# EAGLE design untitled (EAGLE 7.2.0)
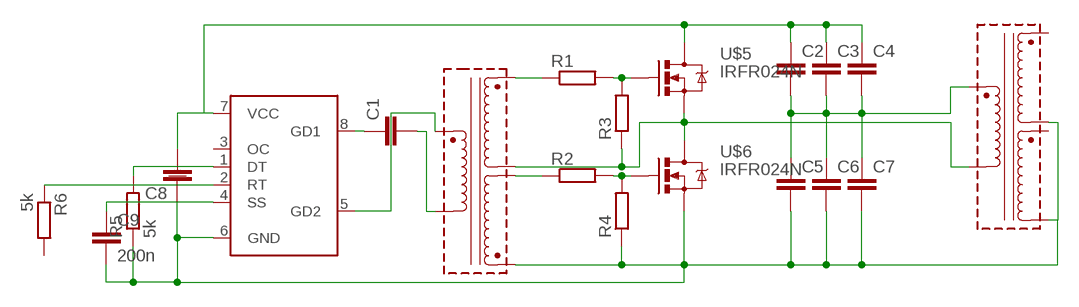
[diagram p0: schematic, sheet 1]

## Parts
C1  CC0805  [C0805]
C2  CC0805  [C0805]
C3  CC0805  [C0805]
C4  CC0805  [C0805]
C5  CC0805  [C0805]
C6  CC0805  [C0805]
C7  CC0805  [C0805]
C8  CC0805  [C0805]
C9  200n  CC0805  [C0805]
R1  R0805  [R0805]
R2  R0805  [R0805]
R3  R0805  [R0805]
R4  R0805  [R0805]
R5  5k  R0805  [R0805]
R6  5k  R0805  [R0805]
U$1  TPS92020  [SO08]
U$2  ADSL_GDT  [ADSL_GDT]
U$3  CCFL  [TRANSFORMER_HVX2]
U$5  IRFR024N  [D-PAK_TO252AA]
U$6  IRFR024N  [D-PAK_TO252AA]

## Nets
N$1: C1.1 U$1.8(GD1)
N$2: C1.2 U$2.GD`(GD2)
N$3: U$1.5(GD2) U$2.GD(GD1)
N$4: R1.1 U$2.OUT1(OUT1+)
N$5: R2.1 U$2.OUT2`(OUT2-)
N$6: R1.2 R3.2 U$5.1(G)
N$7: R2.2 R4.2 U$6.1(G)
N$8: R3.1 U$2.OUT1`(OUT1-) U$3.P$3(GD2) U$5.3(S) U$6.2(D)
N$9: C5.2 C6.2 C7.2 C8.1 C9.2 R4.1 R5.1 U$1.6(GND) U$2.OUT2(OUT2+) U$3.P$6(OUT1-) U$3.P$7(OUT2+) U$6.3(S)
N$10: C2.2 C3.2 C4.2 C5.1 C6.1 C7.1 U$3.P$2(GD1)
N$11: C2.1 C3.1 C4.1 C8.2 U$1.7(VCC) U$5.2(D)
N$12: R5.2 U$1.1(DT)
N$13: C9.1 U$1.4(SS)
N$14: R6.1 U$1.2(RT)
Unconnected: R6.2 U$1.3(OC) U$3.P$5(OUT1+) U$3.P$8(OUT2-)

## Library data of the parts
C1-C9 = CasaLibrary:C: Capacitor
R1-R6 = CasaLibrary:R
U$1 = CasaLibrary:TPS92020
U$2 = CasaLibrary:ADSL_GDT
U$3 = CasaLibrary:CCFL
U$5 U$6 = CasaLibrary:IRFR024N

## Board
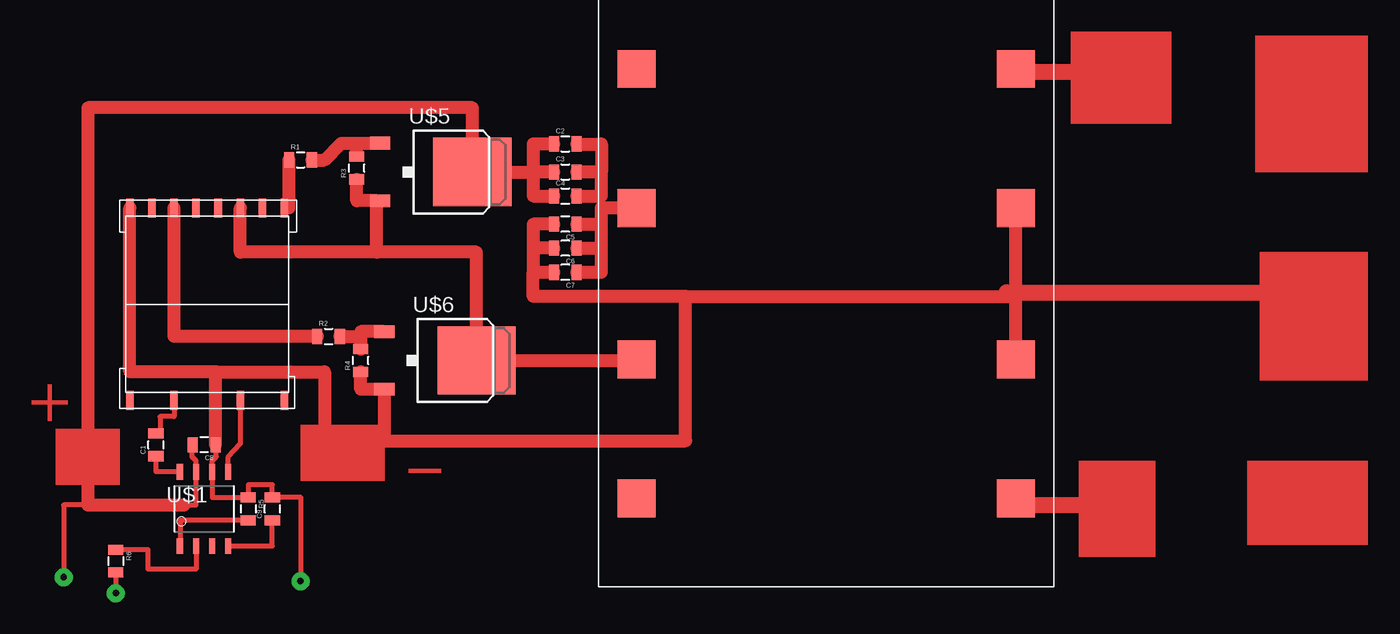
[diagram p1: board, top side]

No outline drawn. Coordinates in mm, seen from the top.
Copper layers (1*16): Top 0.035mm / dielectric 1.5mm / Bottom 0.035mm
Design rules "default": minimum track width 0.2mm, minimum drill 0.2mm, track to track 0.2mm, track to pad 0.2mm, pad to pad 0.2mm, via to via 0.2mm, smd to smd 0.2mm, copper to edge 0.2mm, drill to drill 0.2mm, minimum pad ring 10mil, minimum via ring 8mil, stop-mask expansion 4mil, vias tented up to drill 0mil, thermal gap 10mil

### Footprints (pad centres in the part's own frame; a part is rotated, then mirrored left to right if it is on the bottom)
C0805 = smd 0.8 x 1.2: 1 -0.9,0; 2 0.9,0
R0805 = smd 0.8 x 1.2: 1 -0.9,0; 2 0.9,0
SO08 = smd 0.5 x 1.25: 1 -1.905,-2.934; 2 -0.635,-2.934; 3 0.635,-2.934; 4 1.905,-2.934; 5 1.905,2.934; 6 0.635,2.934; 7 -0.635,2.934; 8 -1.905,2.934
ADSL_GDT = smd 0.6 x 1.5: GD -2.54,8.255; GD` 2.699,8.255; NC -4.286,-6.985; NC@1 -0.794,-6.985; NC@2 0.953,-6.985; NC@3 4.445,-6.985; NC@4 -6.032,8.255; NC@5 6.191,8.255; OUT1 -6.032,-6.985; OUT1` -2.54,-6.985; OUT2 6.191,-6.985; OUT2` 2.699,-6.985
TRANSFORMER_HVX2 = smd 3 x 3: P$1 -18,-15; P$2 -7,-15; P$3 5,-15; P$4 16,-15; P$5 -18,15; P$6 -7,15; P$7 5,15; P$8 16,15
D-PAK_TO252AA = smd 1 x 1.6: 1 -2.28,-4.8; 3 2.28,-4.8 | smd 5.4 x 6.2: 2 0,2.5

### Placement (x,y rotation side)
C1  10.48,20.64 90 top
C2  42.86,44.45 0 top
C3  42.86,42.23 0 top
C4  42.86,40.32 0 top
C5  42.86,38.1 180 top
C6  42.86,36.2 180 top
C7  42.86,34.29 180 top
C8  14.29,20.64 180 top
C9  19.68,15.56 90 top
R1  21.91,43.18 0 top
R2  24.13,29.21 0 top
R3  26.35,42.55 90 top
R4  26.67,27.3 90 top
R5  17.78,15.56 270 top
R6  7.3,11.43 270 top
U$1  14.29,15.56 0 top
U$2  14.61,32.38 180 top
U$3  63.5,32.38 270 top
U$5  33.02,42.23 270 top
U$6  33.34,27.3 270 top

### Tracks (layer width: path | path; a pad name or v marks a point on that pad's centre or on a via)
N$1
  Top 0.406: U$1.8 10.48,18.49 C1.1
N$2
  Top 0.406: U$2.GD` 11.91,22.86 10.79,22.86 10.79,21.54 C1.2
N$3
  Top 0.406: U$1.5 16.19,19.68 17.14,20.71 U$2.GD
N$4
  Top 0.406: U$2.OUT1 21.01,39.37
  Top 1.016: 21.01,39.37 R1.1
N$5
  Top 1.016: R2.1 11.91,29.21 U$2.OUT2`
N$6
  Top 0.406: R3.2 26.35,43.76
  Top 1.016: R1.2 23.81,43.18 25.14,44.51 26.35,44.51 | 26.35,44.51 U$5.1 | 26.35,43.76 26.35,44.51
N$7
  Top 0.406: 26.67,29.59 26.67,29.21
  Top 1.016: U$6.1 26.67,29.59 | R4.2 26.67,29.21 R2.2
N$8
  Top 0.406: 48.5,27.3 U$3.P$3 | 27.94,39.95 U$5.3
  Top 1.016: 48.5,27.3 U$6.2 35.84,35.88 27.94,35.88 | 27.94,35.88 27.94,39.95 26.35,39.95 R3.1 | 27.94,35.88 17.14,35.88 U$2.OUT1`
N$9  (via drill 0.5 pad 1.42)
  Top 0.406: 41.91,34.29 C7.2 | C8.1 15.24,20.59 15.24,19.68 14.92,19.37 U$1.6 14.92,16.46 R5.1 17.78,17.46 19.68,17.46 19.68,16.51 | 15.19,26.35 15.24,26.41 | C9.2 19.68,16.51 | 19.68,16.51 21.91,16.51 v21.91,9.84
  Top 1.016: C5.2 40.32,38.1 40.32,36.2 | 40.32,36.2 40.32,34.29 | 40.32,34.29 C7.2 | C6.2 40.32,36.2 | 28.54,20.95 U$6.3 26.67,25.02 R4.1 | 28.54,20.95 52.39,20.95 52.39,32.38 | 52.39,32.38 40.32,32.38 40.32,34.29 | 52.39,32.38 78.5,32.38 | 78.5,32.38 U$3.P$6 | U$3.P$7 78.5,32.38 | U$2.OUT2 8.41,26.41 15.24,26.41 23.81,26.41 23.81,20.95 28.54,20.95 | C8.1 15.19,26.35
N$10
  Top 0.406: 45.72,40.32 45.72,39.38 45.72,39.37
  Top 1.016: C6.1 45.72,36.2 | 45.72,36.2 45.72,38.1 | 45.72,38.1 45.72,39.37 | 45.72,42.23 45.72,40.32 C4.2 | 45.72,42.23 C3.2 | C5.1 45.72,38.1 | C2.2 45.72,44.45 45.72,42.23 | C7.1 45.72,34.29 45.72,36.2 | U$3.P$2 45.72,39.38
N$11  (via drill 0.5 pad 1.42)
  Top 0.406: C8.2 13.34,20.59 13.34,19.68 13.65,19.37 U$1.7 13.65,15.88 12.7,15.88 | 5.4,15.88 3.17,15.88 v3.17,10.16
  Top 1.016: C2.1 40.32,44.45 40.32,42.23 | 40.32,42.23 40.32,40.32 C4.1 | 40.32,42.23 U$5.2 35.52,47.31 5.08,47.31 5.08,15.88 5.4,15.88 12.7,15.88 | C3.1 40.32,42.23
N$12
  Top 0.406: R5.2 12.38,14.66 U$1.1
N$13
  Top 0.406: U$1.4 19.68,12.62 C9.1
N$14
  Top 0.406: U$1.2 13.65,10.79 9.84,10.79 9.84,12.33 R6.1
N$15  (via drill 0.5 pad 1.42)
  Top 0.406: 7.3,10.48 v7.3,8.89
N$16
  Top 1.27: 77.79,32.7 103.19,32.7 103.19,33.02
N$18
  Top 1.27: 79.06,15.88 86.36,15.88
N$19
  Top 1.27: 87,50.16 87,50.8 86.04,50.8 86.04,50.48 86.68,50.48 86.68,49.85 87,49.85 87,50.16 | 78.74,50.16 87,50.16
(copper drawn outside any net)
  shapes: Top area x17